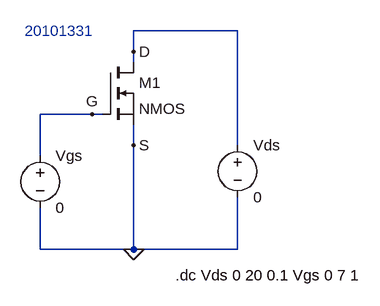
[diagram p0: schematic MOSFET IV.asc]
MOSFET IV.asc, the LTspice schematic file:
Version 4
SHEET 1 880 680
WIRE 368 48 208 48
WIRE 208 80 208 48
WIRE 208 96 208 80
WIRE 144 176 64 176
WIRE 160 176 144 176
WIRE 208 224 208 192
WIRE 368 224 368 48
WIRE 64 240 64 176
WIRE 64 384 64 320
WIRE 208 384 208 224
WIRE 208 384 64 384
WIRE 368 384 368 304
WIRE 368 384 208 384
FLAG 208 384 0
FLAG 144 176 G
FLAG 208 224 S
FLAG 208 80 D
SYMBOL nmos 160 96 R0
SYMATTR InstName M1
SYMBOL voltage 64 224 R0
SYMATTR InstName Vgs
SYMATTR Value 0
SYMBOL voltage 368 208 R0
SYMATTR InstName Vds
SYMATTR Value 0
TEXT 272 424 Left 2 !.dc Vds 0 20 0.1 Vgs 0 7 1
TEXT 40 48 Left 2 ;20101331

The netlist it stands for:
* MOSFET IV.asc
M1 D G 0 0 NMOS
Vgs G 0 0
Vds D 0 0
.model NMOS NMOS
.model PMOS PMOS
.lib standard.mos
.dc Vds 0 20 0.1 Vgs 0 7 1
* 20101331
.backanno
.end